# Altium schematic sheet Bus_and_display.SchDoc
size A4; SheetNumber: 1; SheetTotal: 1
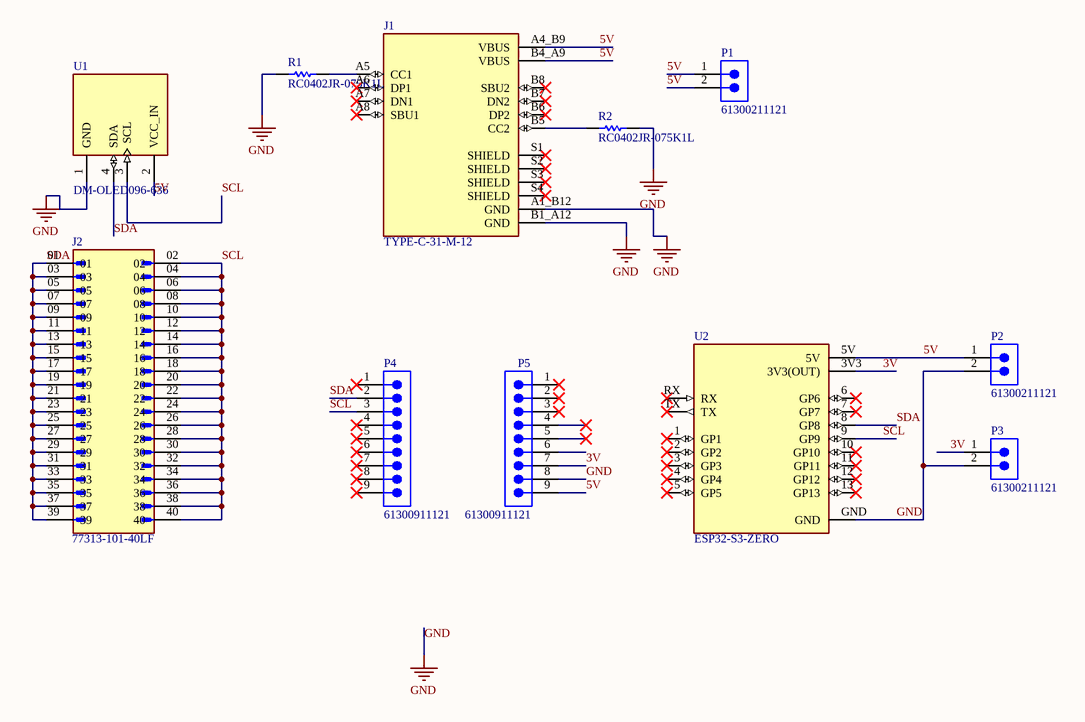
[diagram p0: Bus_and_display.SchDoc]

## Parts
J1  TYPE-C-31-M-12  [HRO_TYPE-C-31-M-12]
J2  77313-101-40LF  [AMPHENOL_77313-101-40LF]
P1  61300211121  [61300211121]
P2  61300211121  [61300211121]
P3  61300211121  [61300211121]
P4  61300911121  [61300911121]
P5  61300911121  [61300911121]
R1  RC0402JR-075K1L  [RESC1005X40X25ML05T10]
R2  RC0402JR-075K1L  [RESC1005X40X25ML05T10]
U1  DM-OLED096-636  [MODULE_DM-OLED096-636]
U2  ESP32-S3-ZERO  [MODULE_ESP32-S3-ZERO]

## Nets
GND: J1.A1_B12(GND) J1.B1_A12(GND) P2.2 P3.2 P5.8 R1.1 R2.2 U1.1(GND) U2.GND
3V: P3.1 P5.7 U2.3V3(3V3(OUT))
5V: J1.A4_B9(VBUS) J1.B4_A9(VBUS) P1.1 P1.2 P2.1 P5.9 U1.2(VCC_IN) U2.5V
SCL: J2.02 J2.04 J2.06 J2.08 J2.10 J2.12 J2.14 J2.16 J2.18 J2.20 J2.22 J2.24 J2.26 J2.28 J2.30 J2.32 J2.34 J2.36 J2.38 J2.40 P4.3 U1.3(SCL) U2.9(GP9)
SDA: J2.01 J2.03 J2.05 J2.07 J2.09 J2.11 J2.13 J2.15 J2.17 J2.19 J2.21 J2.23 J2.25 J2.27 J2.29 J2.31 J2.33 J2.35 J2.37 J2.39 P4.2 U1.4(SDA) U2.8(GP8)
NetJ1_A5: J1.A5(CC1) R1.2
NetJ1_B5: J1.B5(CC2) R2.1

Not connected (* = marked no-connect by the designer): J1 A6(DP1)* A7(DN1)* A8(SBU1)* B6(DP2)* B7(DN2)* B8(SBU2)* S1(SHIELD)* S2(SHIELD)* S3(SHIELD)* S4(SHIELD)*; P4 1* 4* 5* 6* 7* 8* 9*; P5 1* 2* 3* 4* 5* 6; U2 1(GP1)* 2(GP2)* 3(GP3)* 4(GP4)* 5(GP5)* 6(GP6)* 7(GP7)* 10(GP10)* 11(GP11)* 12(GP12)* 13(GP13)* RX* TX*

## Library data of the parts
J1 = TYPE-C-31-M-12: USB Connectors 24 Receptacle 1 8.94*7.3mm RoHS; MF: HRO Electronics Co., Ltd.; SnapEDA_Link: https://www.snapeda.com/parts/TYPE-C-31-M-12/HRO+Electronics+Co.%252C+Ltd./view-part/?ref=snap; Package: Package; Value: *; MP: TYPE-C-31-M-12; Check_prices: https://www.snapeda.com/parts/TYPE-C-31-M-12/HRO+Electronics+Co.%252C+Ltd./view-part/?ref=eda
J2 = 77313-101-40LF: BergStik, Board to Board connector, Unshrouded Header, 2.54 mm Pitch, Vertical, Double Row,Through Hole, 40 Positions; MF: Amphenol; SnapEDA_Link: https://www.snapeda.com/parts/77313-101-40LF/Amphenol/view-part/?ref=snap; Package: None; Value: *; MP: 77313-101-40LF; Check_prices: https://www.snapeda.com/parts/77313-101-40LF/Amphenol/view-part/?ref=eda
P1-P3 = CMP-1712-00002-7: THT Vertical Pin Header WR-PHD, Pitch 2.54 mm, Single Row, 2 pins; Pitch: 2.54mm; Number of Contacts: 2; Connector Type: Male Pin; Gender: Male; Contact Resistance: 20mΩ; Operating Supply Voltage: 250V; Current Rating: 3A; Housing Material: PBT; RoHS: Compliant; Lead Free: Lead Free; Contact Material: Gold; REACH SVHC: No; Min Operating Temperature: -40°C; Termination: Through Hole; Number of Pins: 2; Contact Gender: Male; Packaging: Bulk; Lead Pitch: 2.54mm; Contact Plating: Gold; Orientation: Vertical; Mount: Through Hole; Height: 8.94mm; Color: Black; Number of Positions: 2; Contact Mating Length: 5.9944mm; Max Operating Temperature: 105°C; Voltage Rating: 250V; Number of Rows: 1
P4 P5 = CMP-1502-01080-4: THT Vertical Pin Header WR-PHD, Pitch 2.54 mm, Single Row, 9 pins; Pitch: 2.54mm; Connector Type: Male Pin; Current Rating: 3A; Number of Positions: 9; Operating Supply Voltage: 250V; Gender: Male; Contact Resistance: 20mΩ; Color: Black; Packaging: Bulk; Number of Pins: 9; Contact Plating: Gold; Contact Material: Copper; RoHS: Compliant; Contact Mating Length: 5.9944mm; Termination: Solder; Lead Pitch: 2.54mm; Orientation: Vertical; Number of Contacts: 9; Number of Rows: 1; Mount: Through Hole
R1 R2 = CMP-2002-08025-1: Manufacturer: Yageo / Phycomp; Part Number: RC0402JR-075K1L
U1 = DM-OLED096-636: 0.96â€ 128 X 64 MONOCHROME GRAPHIC OLED DISPLAY MODULE - I2C; SnapEDA_Link: https://www.snapeda.com/parts/DM-OLED096-636/Display+Module/view-part/?ref=snap; Package: Package; Value: *; MF: Display Module; MP: DM-OLED096-636; Check_prices: https://www.snapeda.com/parts/DM-OLED096-636/Display+Module/view-part/?ref=eda
U2 = ESP32-S3-ZERO: ESP32-S3 Mini Development Board, Based on ESP32-S3FH4R2 Dual-Core Processor, 240MHz Running Frequency, 2.4GHz Wi-Fi & Bluetooth 5; MF: Waveshare Electronics; SnapEDA_Link: https://www.snapeda.com/parts/ESP32-S3-Zero/Waveshare+Electronics/view-part/?ref=snap; Package: None; Value: *; MP: ESP32-S3-Zero; Check_prices: https://www.snapeda.com/parts/ESP32-S3-Zero/Waveshare+Electronics/view-part/?ref=eda